# EAGLE design thermal-flashlight-32u4-many (EAGLE 6.5.0)
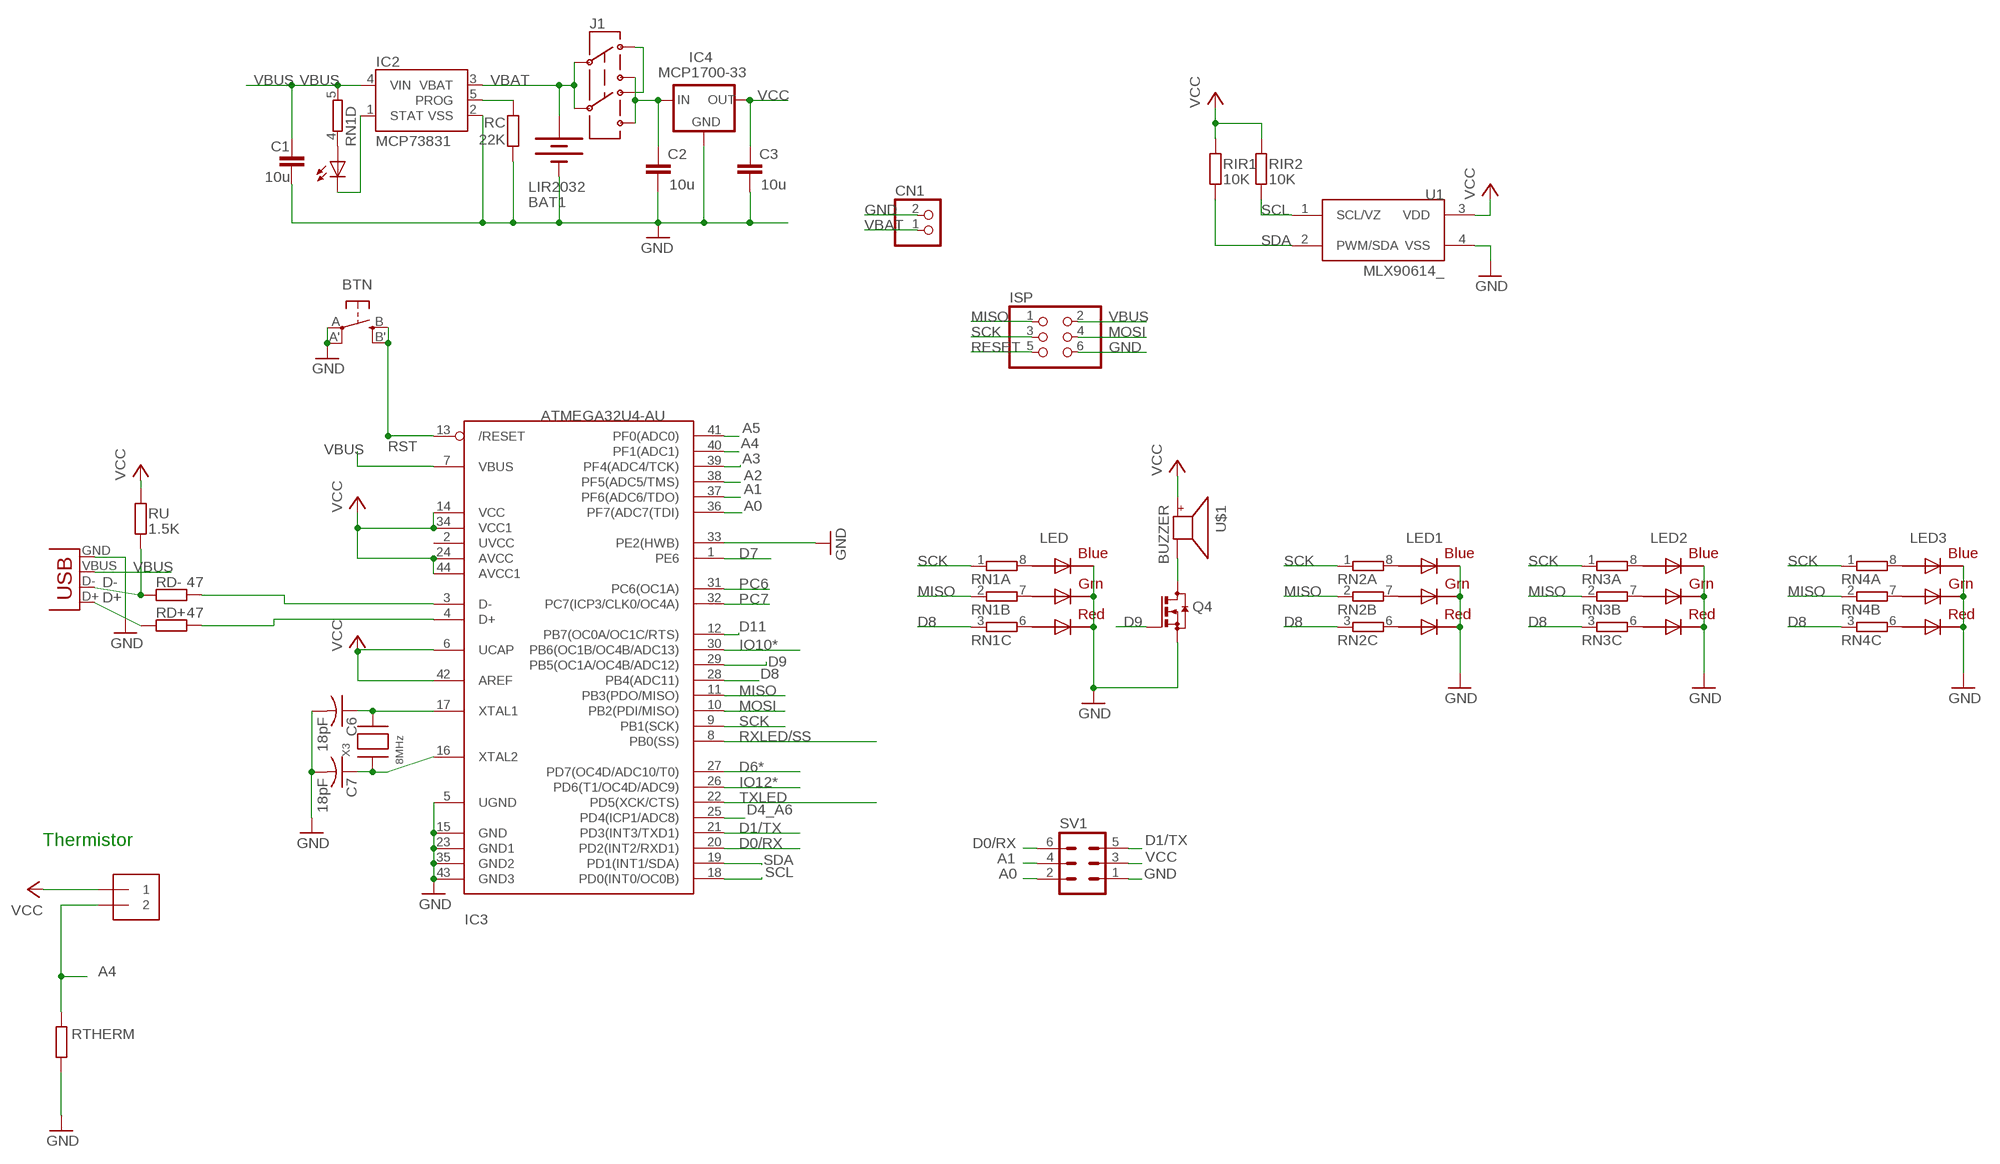
[diagram p0: schematic, sheet 1]

## Parts
BAT1  LIR2032  BATTERYBATTCOM_20MM_PTH_SMT  [BATTCOM_20MM_PTH_SMT]
BTN  EVQQ2  [EVQ-Q2]
C1  10u  C-EUC0805  [C0805]
C2  10u  C-EUC0805  [C0805]
C3  10u  C-EUC0805  [C0805]
C6  18pF  C-USC0805K  [C0805K]
C7  18pF  C-USC0805K  [C0805K]
CHG  0805  LEDCHIPLED_0805  [CHIPLED_0805]
CN1  JST_2PIN-SMT-RA  [JST-PH-2-SMT-RA]
IC2  MCP73831  [SOT23-5]
IC3  ATMEGA32U4-AU  [TQFP44]
IC4  MCP1700-33  MCP1700SOT233  [SOT23]
ISP  PINHD-2X3  [2X03]
J1  AYZ0202  [AYZ0202]
J2  1X2-3.5MM  [1X2-3.5MM]
LED  RGBLED5050  [RGBLED5050]
LED1  RGBLED5050  [RGBLED5050]
LED2  RGBLED5050  [RGBLED5050]
LED3  RGBLED5050  [RGBLED5050]
Q4  BSS123  [SOT23]
RC  22K  R-EU_R0805  [R0805]
RD+  47  R-EU_R0805  [R0805]
RD-  47  R-EU_R0805  [R0805]
RIR1  10K  R-EU_R0805  [R0805]
RIR2  10K  R-EU_R0805  [R0805]
RN1  4R-NEXB38V  [EXB38V]
RN2  4R-NEXB38V  [EXB38V]
RN3  4R-NEXB38V  [EXB38V]
RN4  4R-NEXB38V  [EXB38V]
RTHERM  330  R-EU_0204/7  [0204/7]
RU  1.5K  R-EU_R0805  [R0805]
SV1  MA03-2  [MA03-2]
U1  MLX90614_  [TO-39]
U$1  BUZZER  [SMT-8585-BUZZER]
X1  USBSMD  [USB-MINIB]
X3  8MHz  XTALNX5032  [NX5032]

## Nets
A0: IC3.36(PF7(ADC7(TDI)) SV1.2
A1: IC3.37(PF6(ADC6/TDO)) SV1.4
A2: IC3.38(PF5(ADC5/TMS))
A3: IC3.39(PF4(ADC4/TCK))
A4: IC3.40(PF1(ADC1)) J2.2 RTHERM.2
A5: IC3.41(PF0(ADC0))
D0/RX: IC3.20(PD2(INT2/RXD1)) SV1.6
D1/TX: IC3.21(PD3(INT3/TXD1)) SV1.5
D4_A6: IC3.25(PD4(ICP1/ADC8))
D6*: IC3.27(PD7(OC4D/ADC10/T0))
D7: IC3.1(PE6)
D8: IC3.28(PB4(ADC11)) RN1.3 RN2.3 RN3.3 RN4.3
D9: IC3.29(PB5(OC1A/OC4B/ADC12)) Q4.1(G)
D11: IC3.12(PB7(OC0A/OC1C/RTS))
D+: RD+.1 X1.D+
D-: RD-.1 RU.1 X1.D-
GND: BAT1.P$1(-) BTN.A'(P1) BTN.A(P) C1.2 C2.2 C3.2 C6.2 C7.2 CN1.2 IC2.2(VSS) IC3.5(UGND) IC3.15(GND) IC3.23(GND1) IC3.33(PE2(HWB)) IC3.35(GND2) IC3.43(GND3) IC4.1(GND) ISP.6 LED1.4(BLUE_C) LED1.5(RED_C) LED1.6(GREEN_C) LED2.4(BLUE_C) LED2.5(RED_C) LED2.6(GREEN_C) LED3.4(BLUE_C) LED3.5(RED_C) LED3.6(GREEN_C) LED.4(BLUE_C) LED.5(RED_C) LED.6(GREEN_C) Q4.2(S) RC.1 RTHERM.1 SV1.1 U1.4(VSS) X1.GND
IO10*: IC3.30(PB6(OC1B/OC4B/ADC13))
IO12*: IC3.26(PD6(T1/OC4D/ADC9))
MISO: IC3.11(PB3(PDO/MISO)) ISP.1 RN1.2 RN2.2 RN3.2 RN4.2
MOSI: IC3.10(PB2(PDI/MISO)) ISP.4
N$1: J1.3 J1.6
N$2: LED1.3(BLUE_A) RN2.8
N$3: LED1.1(GREEN_A) RN2.7
N$4: LED.3(BLUE_A) RN1.8
N$5: CHG.C IC2.1(STAT)
N$6: IC2.5(PROG) RC.2
N$7: Q4.3(D) U$1.-
N$8: LED.1(GREEN_A) RN1.7
N$9: LED.2(RED_A) RN1.6
N$10: CHG.A RN1.4
N$11: IC3.4(D+) RD+.2
N$12: LED1.2(RED_A) RN2.6
N$13: LED2.3(BLUE_A) RN3.8
N$14: LED2.1(GREEN_A) RN3.7
N$15: C7.1 IC3.16(XTAL2) X3.P$1
N$16: C6.1 IC3.17(XTAL1) X3.P$2
N$17: LED2.2(RED_A) RN3.6
N$18: IC3.3(D-) RD-.2
N$19: LED3.3(BLUE_A) RN4.8
N$20: LED3.1(GREEN_A) RN4.7
N$21: LED3.2(RED_A) RN4.6
PC6: IC3.31(PC6(OC1A))
PC7: IC3.32(PC7(ICP3/CLK0/OC4A))
RESET: ISP.5
RST: BTN.B'(S1) BTN.B(S) IC3.13(/RESET)
RXLED/SS: IC3.8(PB0(SS))
SCK: IC3.9(PB1(SCK)) ISP.3 RN1.1 RN2.1 RN3.1 RN4.1
SCL: IC3.18(PD0(INT0/OC0B)) RIR2.1 U1.1(SCL/VZ)
SDA: IC3.19(PD1(INT1/SDA)) RIR1.1 U1.2(PWM/SDA)
TXLED: IC3.22(PD5(XCK/CTS))
VBAT: BAT1.P$2(+) CN1.1 IC2.3(VBAT) J1.2 J1.5
VBUS: C1.1 IC2.4(VIN) IC3.7(VBUS) ISP.2 RN1.5 X1.VBUS
VCC: C3.1 IC3.6(UCAP) IC3.14(VCC) IC3.24(AVCC) IC3.34(VCC1) IC3.42(AREF) IC3.44(AVCC1) IC4.2(OUT) J2.1 RIR1.2 RIR2.2 RU.2 SV1.3 U1.3(VDD) U$1.+
VDD: C2.1 IC4.3(IN) J1.1 J1.4
Unconnected: IC3.2(UVCC) RN2.4 RN2.5 RN3.4 RN3.5 RN4.4 RN4.5

## Notes on the sheet
- Thermistor

## Library data of the parts
BAT1 = SparkFunNew:BATTERY: Battery Holders Various common sizes : AA, AAA, 20mm coin cell and 12mm coin cell.
BTN = adafruit:EVQQ2: SMT 6mm switch, EVQQ2 series http://www.ladyada.net/library/eagle
C1-C3 = resistor:C-EU: CAPACITOR, European symbol
C6 C7 = adafruit:C-US: CAPACITOR, American symbol
CHG = led:LED: LED OSRAM: - CHIPLED LG R971, LG N971, LY N971, LG Q971, LY Q971, LO R971, LY R971 LH N974, LH R974 LS Q976, LO Q976, LY Q976 LO Q996 - Hyper CHIPLED LW Q18S LB Q993, LB Q99A, LB R99A - SideLED LS A670, LO A670, LY A670, LG A670, LP A670 LB A673, LV A673, LT A673, LW A673 LH A674 LY A675 LS A676, LA A676, LO A676, LY A676, LW A676 LS A679, LY A679, LG A679 - Hyper Micro SIDELED® LS Y876, LA Y876, LO Y876, LY Y876 LT Y87S - SmartLED LW L88C, LW L88S LB L89C, LB L89S, LG L890 LS L89K, LO L89K, LY L89K LS L896, LA L896, LO L896, LY L896 - TOPLED LS T670, LO T670, LY T670, LG T670, LP T670 LSG T670, LSP T670, LSY T670, LOP T670, LYG T670 LG T671, LOG T671, LSG T671 LB T673, LV T673, LT T673, LW T673 LH T674 LS T676, LA T676, LO T676, LY T676, LB T676, LH T676, LSB T676, LW T676 LB T67C, LV T67C, LT T67C, LS T67K, LO T67K, LY T67K, LW E67C LS E67B, LA E67B, LO E67B, LY E67B, LB E67C, LV E67C, LT E67C LW T67C LS T679, LY T679, LG T679 LS T770, LO T770, LY T770, LG T770, LP T770 LB T773, LV T773, LT T773, LW T773 LH T774 LS E675, LA E675, LY E675, LS T675 LS T776, LA T776, LO T776, LY T776, LB T776 LHGB T686 LT T68C, LB T68C - Hyper Mini TOPLED® LB M676 - Mini TOPLED Santana® LG M470 LS M47K, LO M47K, LY M47K Source: http://www.osram.convergy.de LUXEON: - LUMILED® LXK2-PW12-R00, LXK2-PW12-S00, LXK2-PW14-U00, LXK2-PW14-V00 LXK2-PM12-R00, LXK2-PM12-S00, LXK2-PM14-U00 LXK2-PE12-Q00, LXK2-PE12-R00, LXK2-PE12-S00, LXK2-PE14-T00, LXK2-PE14-U00 LXK2-PB12-K00, LXK2-PB12-L00, LXK2-PB12-M00, LXK2-PB14-N00, LXK2-PB14-P00, LXK2-PB14-Q00 LXK2-PR12-L00, LXK2-PR12-M00, LXK2-PR14-Q00, LXK2-PR14-R00 LXK2-PD12-Q00, LXK2-PD12-R00, LXK2-PD12-S00 LXK2-PH12-R00, LXK2-PH12-S00 LXK2-PL12-P00, LXK2-PL12-Q00, LXK2-PL12-R00 Source: www.luxeon.com KINGBRIGHT: KA-3528ASYC Source: www.kingbright.com
CN1 = adafruit:JST_2PIN: JST 2-Pin Connectors of various flavors SMT-RA (S2B-PH-SM4) 4UConnector #17311 SMT (B2B-PH-SM4) THM-RA (S2B-PH) THM (B2B-PH)
IC2 = SparkFunNew:MCP73831: Microchip's MCP73831 Miniature single cell, fully integrated Li-Ion, Li-polymer charge management controller http://ww1.microchip.com/downloads/en/DeviceDoc/21984a.pdf
IC3 = adaprog:ATMEGA32U4
IC4 = adafruit:MCP1700: VOLTAGE REGULATOR
ISP = pinhead:PINHD-2X3: PIN HEADER
J1 = SparkFunNew:AYZ0202: SPDT Slide Switch Simple SMD single-pull double-throw slide switch. Good for less than 350mA power switch, switching UARTs between devices, etc. Spark Fun Electronics SKU : COM-00597
J2 = adafruit:1X2: 3.5mm Terminal block http://www.ladyada.net/library/pcb/eaglelibrary.html
LED LED1-LED3 = adafruit:RGBLED: For 5050 RGB LEDs, the order of the LEDs may vary from one manufacturer to another!
Q4 = transistor-small-signal:BSS123: N-CHANNEL MOS FET
RC RD+ RD- RIR1 RIR2 RTHERM RU = rcl:R-EU_: RESISTOR, European symbol
RN1-RN4 = resistor-dil:4R-N: Array Chip Resistor Source: RS Component / Phycomp; OC_FARNELL: unknown; OC_NEWARK: unknown
SV1 = con-lstb:MA03-2: PIN HEADER; OC_FARNELL: unknown; OC_NEWARK: unknown
U1 = SparkFun:MLX90614: Melexis IR Thermometer
U$1 = adafruit:BUZZER
X1 = SparkFun:USB: USB Connectors USB-B-PTH is fully proven SKU : PRT-00139 USB-miniB is fully proven SKU : PRT-00587 USB-A-PCB is untested. USB-A-H is throughly reviewed, but untested. Spark Fun Electronics SKU : PRT-00437 USB-B-SMT is throughly reviewed, but untested. Needs silkscreen touching up. USB-A-S has not been used/tested USB-MB-H has not been used/tested
X3 = adaprog:XTAL

## Net classes
1 power: width 0.254 mm, clearance 0.203 mm

## Board
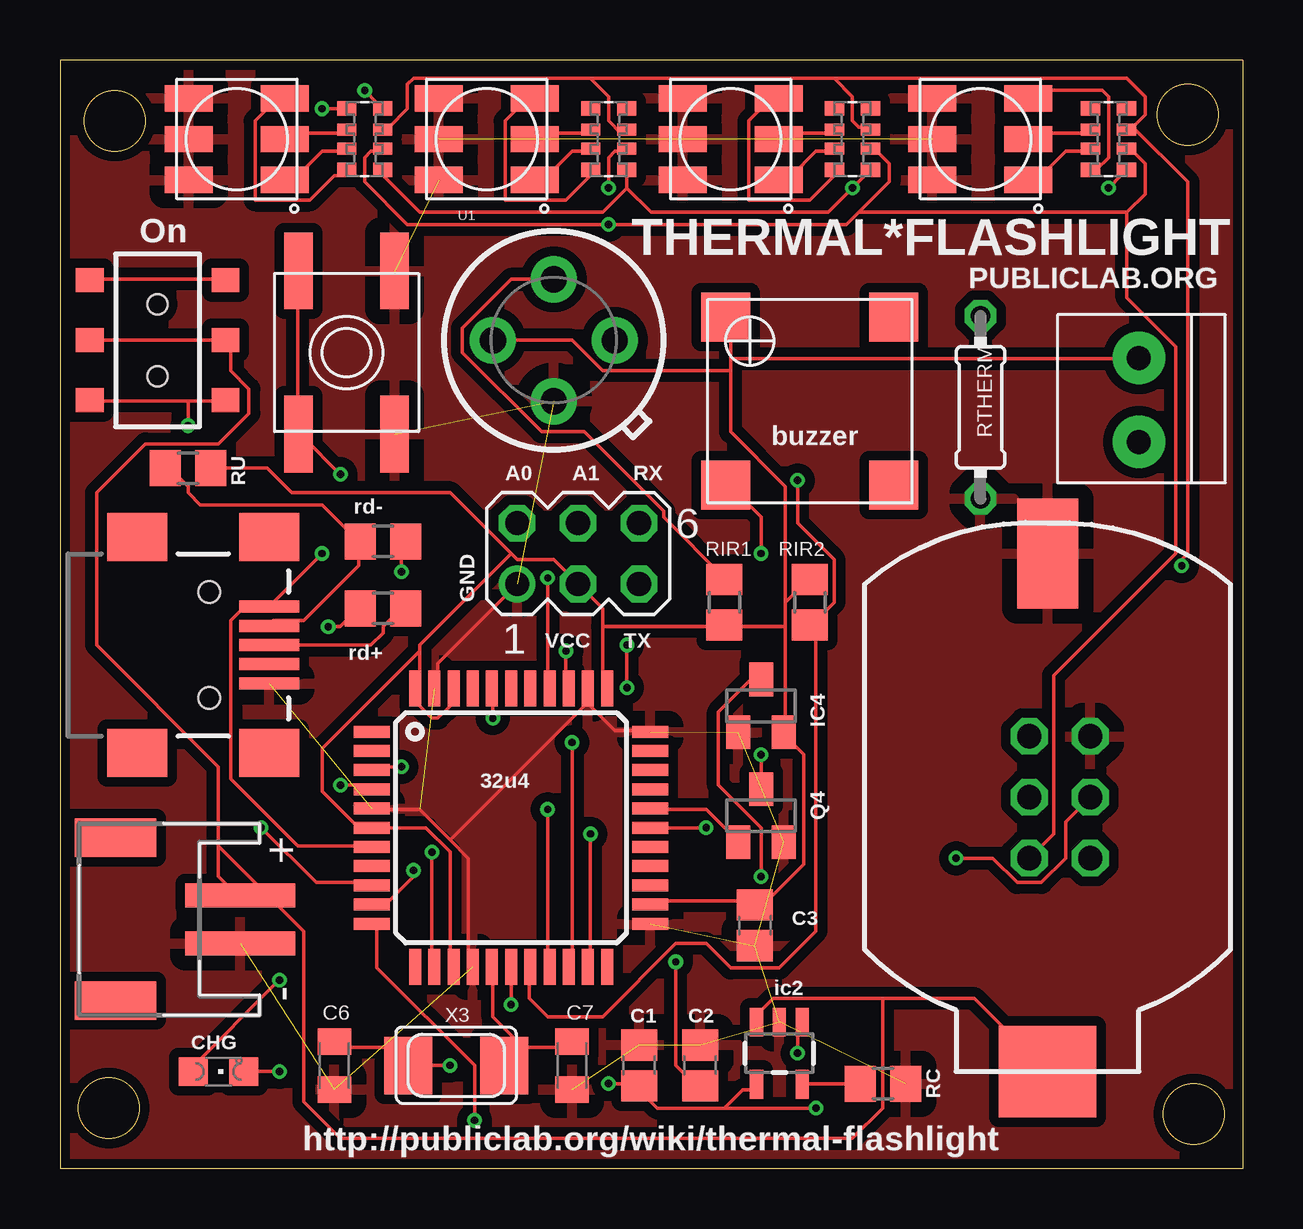
[diagram p1: board, top side]
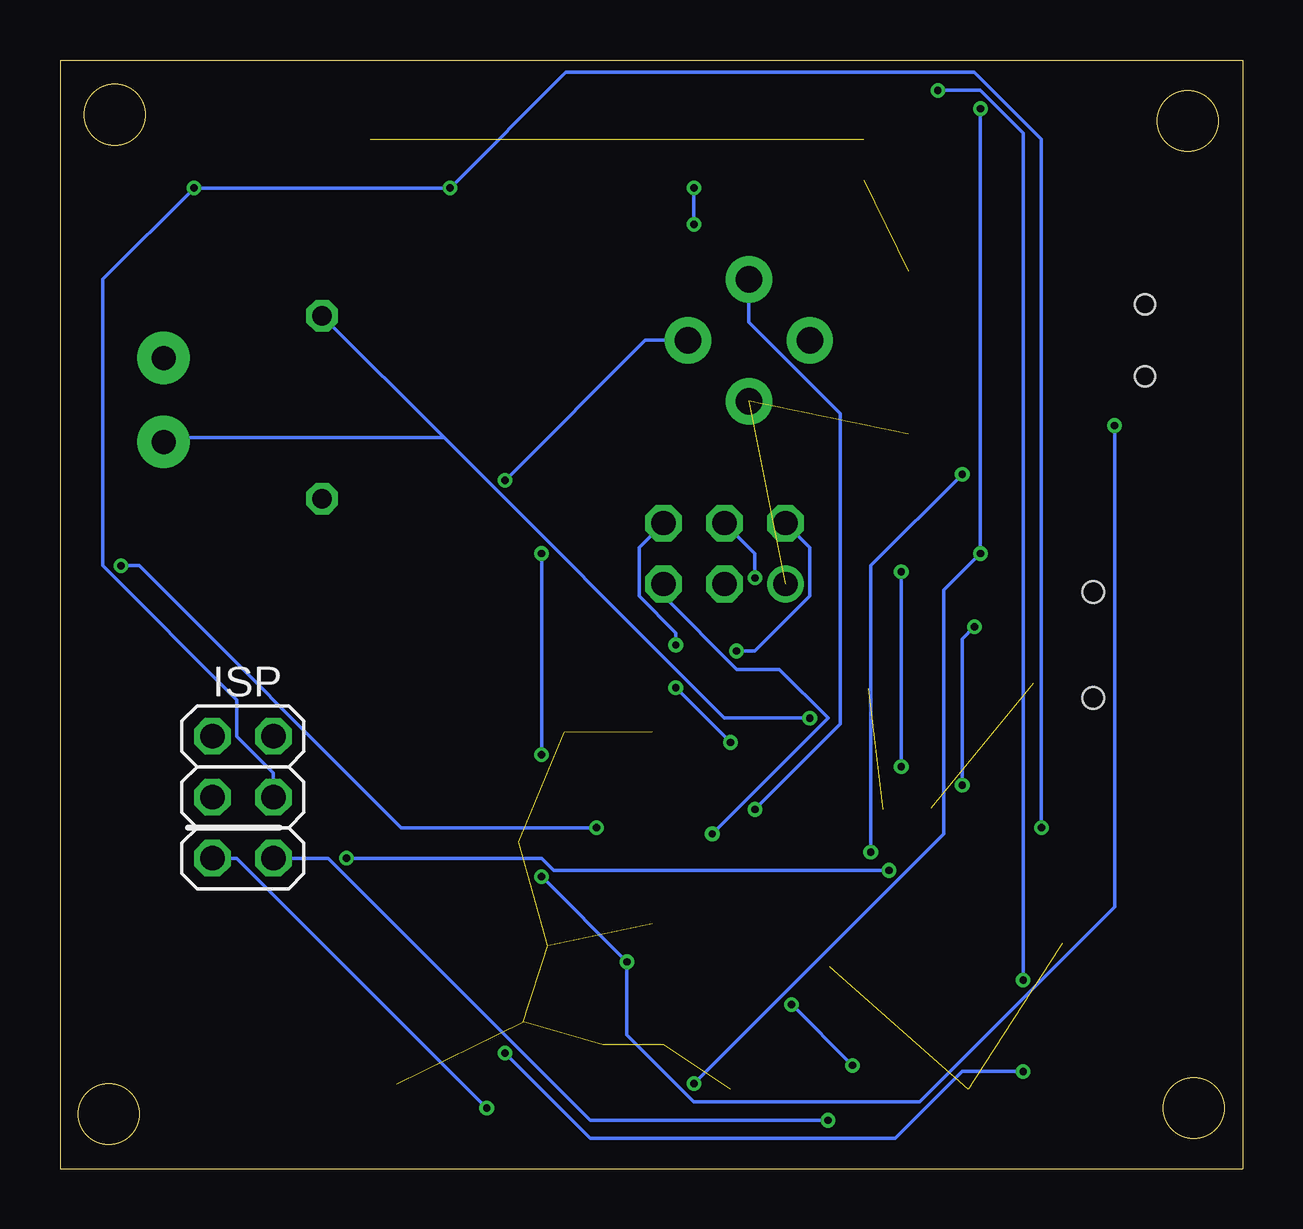
[diagram p2: board, bottom side, seen from below]

Size 49.28 x 46.23 mm. Coordinates in mm from the lower left corner, seen from the top.
Outline: 49.28,46.23 0,46.23 0,0 49.28,0 49.28,46.23
Outline: circle at 2.03,2.54 radius 1.27
Outline: circle at 2.29,43.69 radius 1.27
Outline: circle at 46.99,43.94 radius 1.27
Outline: circle at 47.24,2.29 radius 1.27
Copper layers (1*16): Top 0.035mm / dielectric 1.5mm / Bottom 0.035mm
Design rules "Fusion_eagle_rule_v1.1 *": minimum track width 6mil, minimum drill 12mil, track to track 6mil, track to pad 6mil, pad to pad 6mil, via to via 6mil, smd to smd 0mil, copper to edge 10mil, drill to drill 10mil, minimum pad ring 10mil, minimum via ring 6mil, stop-mask expansion 2mil, vias tented up to drill 100mil, thermal gap 25mil
vRestrict: area 5.8,3.6 to 7.4,4.3

### Footprints (pad centres in the part's own frame; a part is rotated, then mirrored left to right if it is on the bottom)
BATTCOM_20MM_PTH_SMT = smd 4.572 x 2.54: P$1 0,0 | smd 3.81 x 4.064: P$2 21.59,0
EVQ-Q2 = smd 3.2 x 1.2: A -3.4,-2; A' 3.4,-2; B -3.4,2; B' 3.4,2
C0805 = smd 1.3 x 1.5: 1 -0.85,0; 2 0.85,0
C0805K = smd 1.1 x 1.4: 1 -1,0; 2 1,0
CHIPLED_0805 = smd 1.2 x 1.2: A 0,-1.05; C 0,1.05
JST-PH-2-SMT-RA = smd 1 x 4.6: 1 1,-3.7; 2 -1,-3.7 | smd 1.6 x 3.4: NC1 -3.4,1.5; NC2 3.4,1.5
SOT23-5 = smd 0.55 x 1.2: 1 -0.95,-1.3; 2 0,-1.3; 3 0.95,-1.3; 4 0.95,1.3; 5 -0.95,1.3
TQFP44 = smd 1.5 x 0.5: 1 -5.8,4; 2 -5.8,3.2; 3 -5.8,2.4; 4 -5.8,1.6; 5 -5.8,0.8; 6 -5.8,0; 7 -5.8,-0.8; 8 -5.8,-1.6; 9 -5.8,-2.4; 10 -5.8,-3.2; 11 -5.8,-4; 23 5.8,-4; 24 5.8,-3.2; 25 5.8,-2.4; 26 5.8,-1.6; 27 5.8,-0.8; 28 5.8,0; 29 5.8,0.8; 30 5.8,1.6; 31 5.8,2.4; 32 5.8,3.2; 33 5.8,4 | smd 0.5 x 1.5: 12 -4,-5.8; 13 -3.2,-5.8; 14 -2.4,-5.8; 15 -1.6,-5.8; 16 -0.8,-5.8; 17 0,-5.8; 18 0.8,-5.8; 19 1.6,-5.8; 20 2.4,-5.8; 21 3.2,-5.8; 22 4,-5.8; 34 4,5.8; 35 3.2,5.8; 36 2.4,5.8; 37 1.6,5.8; 38 0.8,5.8; 39 0,5.8; 40 -0.8,5.8; 41 -1.6,5.8; 42 -2.4,5.8; 43 -3.2,5.8; 44 -4,5.8
SOT23 = smd 1 x 1.4: 1 -0.95,-1.1; 2 0.95,-1.1; 3 0,1.1
2X03 = drill 1.016 octagon: 1 -2.54,-1.27; 2 -2.54,1.27; 3 0,-1.27; 4 0,1.27; 5 2.54,-1.27; 6 2.54,1.27
AYZ0202 = smd 1 x 1.15: 1 -2.5,2.825; 2 0,2.825; 3 2.5,2.825; 4 -2.5,-2.825; 5 0,-2.825; 6 2.5,-2.825 | hole 0.85: 1.5,0; -1.5,0
1X2-3.5MM = drill 1 pad 2.184: 1 1.8,0; 2 -1.7,0
RGBLED5050 = smd 2 x 1.1: 1 -2,1.7; 2 -2,0; 3 -2,-1.7; 4 2,-1.7; 5 2,0; 6 2,1.7
R0805 = smd 1.3 x 1.5: 1 -0.95,0; 2 0.95,0
EXB38V = smd 0.6 x 0.8: 1 -1.275,-0.75; 4 1.275,-0.75; 5 1.275,0.75; 8 -1.275,0.75 | smd 0.5 x 0.8: 2 -0.4,-0.75; 3 0.4,-0.75; 6 0.4,0.75; 7 -0.4,0.75
0204/7 = drill 0.813 octagon: 1 -3.81,0; 2 3.81,0
MA03-2 = drill 1.016: 1 -2.54,-1.27 | drill 1.016 octagon: 2 -2.54,1.27; 3 0,-1.27; 4 0,1.27; 5 2.54,-1.27; 6 2.54,1.27
TO-39 = drill 1.1 pad 1.93: 1 2.54,0; 2 0,2.54; 3 -2.54,0; 4 0,-2.54
SMT-8585-BUZZER = smd 2.05 x 2.05: + -3.5,-3.5; - 3.5,-3.5; NC1 -3.5,3.5; NC2 3.5,3.5
USB-MINIB = smd 2.5 x 0.5: D+ 2.5,0; D- 2.5,0.8; GND 2.5,-1.6; ID 2.5,-0.8; VBUS 2.5,1.6 | smd 2.5 x 2: GND@1 -3,-4.5; GND@2 -3,4.5; GND@3 2.5,4.5; GND@4 2.5,-4.5 | hole 0.9: 0,2.2; 0,-2.2
NX5032 = smd 2 x 2.4: P$1 2,0; P$2 -2,0

### Placement (x,y rotation side)
BAT1  41.15,25.65 270 top
BTN  11.94,34.04 90 top
C1  24.13,4.32 90 top
C2  26.67,4.32 90 top
C3  28.96,10.16 270 top
C6  11.43,4.32 270 top
C7  21.34,4.32 270 top
CHG  6.6,4.06 270 top
CN1  3.81,10.41 90 top
IC2  29.97,4.83 180 top
IC3  18.8,14.22 0 top
IC4  29.21,19.3 0 top
ISP  41.66,15.49 90 bottom
J1  4.06,34.54 90 top
J2  44.96,32 90 top
LED  7.37,42.93 180 top
LED1  17.78,42.93 180 top
LED2  27.94,42.93 180 top
LED3  38.35,42.93 180 top
Q4  29.21,14.73 0 top
RC  34.29,3.56 180 top
RD+  13.46,23.37 180 top
RD-  13.46,26.16 0 top
RIR1  27.69,23.62 270 top
RIR2  31.24,23.62 90 top
RN1  12.7,42.93 90 top
RN2  22.86,42.93 90 top
RN3  33.02,42.93 90 top
RN4  43.69,42.93 90 top
RTHERM  38.35,31.75 90 top
RU  5.33,29.21 0 top
SV1  21.59,25.65 0 top
U1  20.57,34.54 0 top
U$1  31.24,32 270 top
X1  6.22,21.84 0 top
X3  16.51,4.32 0 top

### Tracks (layer width: path | path; a pad name or v marks a point on that pad's centre or on a via)
A0  (via drill 0.3)
  Top 0.152: v21.08,21.59 21.08,20.07 IC3.36
  Bottom 0.152: v21.08,21.59 20.32,21.59 18.03,23.88 18.03,25.91 SV1.2
A1  (via drill 0.3)
  Top 0.152: v20.32,24.64 20.32,20.07 IC3.37
  Bottom 0.152: v20.32,24.64 20.32,25.65 SV1.4
A4  (via drill 0.3)
  Top 0.152: v18.03,18.8 18.03,19.81 IC3.40
  Bottom 0.152: v18.03,18.8 21.59,18.8 33.27,30.48 | RTHERM.2 33.27,30.48 | 33.27,30.48 44.96,30.48 J2.2
D0/RX  (via drill 0.3)
  Top 0.152: v21.34,17.78 21.34,8.64 IC3.20 | v23.62,21.84 v23.62,20.07
  Bottom 0.152: v23.62,20.07 v21.34,17.78 | v23.62,21.84 23.62,22.35 25.15,23.88 25.15,25.91 SV1.6
D1/TX  (via drill 0.3)
  Top 0.152: v22.1,13.97 22.1,8.64 IC3.21
  Bottom 0.152: v22.1,13.97 17.27,18.8 19.3,20.83 21.08,20.83 24.13,23.88 SV1.5
D8  (via drill 0.3)
  Top 0.152: 22.1,45.47 14.73,45.47 14.48,45.21 14.48,44.2 13.72,43.43 13.46,43.43 RN1.3 | 22.1,45.47 22.86,44.7 22.86,43.69 23.37,43.18 RN2.3 | 32.26,45.47 33.02,44.7 33.02,43.69 33.27,43.43 33.53,43.43 RN3.3 | 22.1,45.47 32.26,45.47 | 44.7,43.43 44.45,43.43 RN4.3 44.7,43.43 | 44.7,43.43 45.21,43.94 45.21,44.7 44.45,45.47 32.26,45.47 | v26.92,14.22 IC3.28 | v46.74,25.15 46.74,25.4 46.99,25.65 46.99,41.15 44.7,43.43
  Bottom 0.152: v26.92,14.22 35.05,14.22 45.97,25.15 v46.74,25.15
D9
  Top 0.152: Q4.1 28.19,13.72 26.92,14.99 24.64,14.99 IC3.29
D+
  Top 0.152: X1.D+ 12.95,21.84 13.46,22.35 13.46,22.61 14.22,23.37 RD+.1
D-
  Top 0.152: 12.45,26.16 10.92,27.69 5.84,27.69 5.33,28.19 5.33,28.45 4.57,29.21 RU.1 | 12.45,26.16 12.45,25.15 10.16,22.86 8.89,22.86 X1.D- | 12.45,26.16 RD-.1
GND  (18 unrouted)
  Top 0.152: 16.26,13.72 14.99,14.99 13.21,14.99 IC3.5 | 16.26,13.72 17.02,12.95 17.02,8.64 IC3.15 | SV1.1 15.75,21.08 15.75,20.07 IC3.43 | 22.1,19.56 22.1,19.3 23.11,18.29 24.38,18.29 IC3.33 | 22.1,19.56 22.1,19.81 IC3.35 22.1,19.56 | 22.1,19.56 16.26,13.72
  pour Top (isolate 0.406): 0.25,45.97 49.02,45.97 49.02,0.25 0.25,0.25
MISO  (via drill 0.3)
  Top 0.152: 33.27,39.88 34.54,41.15 34.54,41.91 33.78,42.67 RN3.2 | 33.27,39.88 32.77,39.37 v22.86,39.37 14.48,39.37 12.7,41.15 12.7,42.16 12.95,42.42 13.21,42.42 RN1.2 | v22.86,40.89 22.86,42.16 23.11,42.42 23.37,42.42 RN2.2 | 44.45,39.88 45.21,40.64 45.21,41.91 44.7,42.42 44.45,42.42 RN4.2 | 33.27,39.88 44.45,39.88 | v17.27,2.03 17.27,4.32 13.21,8.38 13.21,10.16 IC3.11 | 44.45,39.88 44.45,36.32 46.48,34.29 46.48,25.65 41.4,20.57 41.4,13.97 ISP.1
  Bottom 0.152: v22.86,39.37 v22.86,40.89 | v17.27,2.03 27.18,2.03 38.1,12.95 ISP.1
MOSI  (via drill 0.3)
  Top 0.152: v14.73,12.45 14.73,12.19 13.72,11.18 13.21,11.18 IC3.10 | v37.34,12.95 38.86,12.95 39.88,11.94 40.89,11.94 41.91,12.95 41.91,14.48 ISP.4
  Bottom 0.152: v14.73,12.45 28.7,12.45 29.21,12.95 v37.34,12.95
N$1
  Top 0.152: J1.3 1.27,37.08 6.86,37.08 J1.6
N$2
  Top 0.152: RN2.8 22.1,41.4 21.08,40.39 18.54,40.39 18.54,43.69 19.56,44.7 LED1.3
N$3
  Top 0.152: RN2.7 22.1,42.42 21.34,42.42 20.32,41.4 19.81,41.4 LED1.1
N$4
  Top 0.152: RN1.8 11.94,41.4 11.43,41.4 10.41,40.39 8.13,40.39 8.13,43.69 9.14,44.7 LED.3
N$5  (via drill 0.3)
  Top 0.152: v9.14,4.06 CHG.C | v30.73,4.83 30.73,6.1 IC2.1
  Bottom 0.152: v9.14,4.06 11.68,4.06 14.48,1.27 27.18,1.27 v30.73,4.83
N$6
  Top 0.152: RC.2 30.99,3.56 IC2.5
N$7  (via drill 0.3)
  Top 0.152: v29.21,17.27 Q4.3 | v29.21,25.65 29.21,27.18 27.94,28.45 U$1.-
  Bottom 0.152: v29.21,25.65 v29.21,17.27
N$8
  Top 0.152: RN1.7 11.94,42.42 10.92,42.42 9.91,41.4 9.4,41.4 LED.1
N$9
  Top 0.152: RN1.6 11.94,43.18 9.65,43.18 9.4,42.93 LED.2
N$10  (via drill 0.3)
  Top 0.152: v12.7,44.96 13.21,44.45 RN1.4 | v9.14,7.87 5.33,4.06 CHG.A
  Bottom 0.152: v12.7,44.96 10.92,44.96 9.14,43.18 v9.14,7.87
N$11  (via drill 0.3)
  Top 0.152: v11.68,16 12.95,16 IC3.4 | v11.18,22.61 11.68,22.61 12.45,23.37 RD+.2
  Bottom 0.152: v11.68,16 11.68,22.1 v11.18,22.61
N$12
  Top 0.152: RN2.6 22.1,43.18 20.07,43.18 19.81,42.93 LED1.2
N$13
  Top 0.152: RN3.8 32.26,41.4 31.24,40.39 28.7,40.39 28.7,43.69 29.72,44.7 LED2.3
N$14
  Top 0.152: RN3.7 32.26,42.42 31.5,42.42 30.48,41.4 29.97,41.4 LED2.1
N$15
  Top 0.152: 19.3,5.08 21.34,5.08 C7.1 | 19.3,5.08 18.54,4.32 X3.P$1 19.3,5.08 | 19.3,5.08 18.03,6.35 18.03,8.38 IC3.16
N$16  (via drill 0.3)
  Top 0.152: C6.1 11.43,5.08 13.72,5.08 14.48,4.32 X3.P$2 v16.26,4.32 | v18.8,6.86 IC3.17
  Bottom 0.152: v16.26,4.32 v18.8,6.86
N$17
  Top 0.152: RN3.6 32.26,43.18 30.23,43.18 29.97,42.93 LED2.2
N$18  (via drill 0.3)
  Top 0.152: v14.22,16.76 13.21,16.76 IC3.3 | v14.22,24.89 14.22,26.16 RD-.2
  Bottom 0.152: v14.22,24.89 v14.22,16.76
N$19
  Top 0.152: RN4.8 43.18,41.66 43.69,42.16 43.69,44.7 43.43,44.96 40.64,44.96 40.39,44.7 LED3.3
N$20
  Top 0.152: RN4.7 42.93,42.42 41.91,42.42 40.89,41.4 40.39,41.4 LED3.1
N$21
  Top 0.152: RN4.6 42.93,43.18 40.64,43.18 40.39,42.93 LED3.2
RST  (via drill 0.3)
  Top 0.152: v15.49,13.21 15.49,8.64 IC3.13 | v11.68,28.96 10.16,30.48 BTN.B 9.91,30.73 9.91,37.34 BTN.B'
  Bottom 0.152: v15.49,13.21 15.49,25.15 v11.68,28.96
SCK  (via drill 0.3)
  Top 0.152: 23.62,40.89 22.61,39.88 14.99,39.88 13.46,41.4 RN1.1 | 23.62,40.89 23.62,41.4 RN2.1 | 23.62,40.89 24.64,39.88 32,39.88 v33.02,40.89 33.53,41.4 RN3.1 | v43.69,40.89 44.2,41.4 RN4.1 | v8.38,14.22 10.67,11.94 12.95,11.94 IC3.9
  Bottom 0.152: v8.38,14.22 8.38,42.93 11.18,45.72 28.19,45.72 v33.02,40.89 v43.69,40.89 47.5,37.08 47.5,25.15 41.91,19.56 41.91,18.03 40.39,16.51 ISP.3
SCL  (via drill 0.3)
  Top 0.152: 31.24,22.61 31.5,22.35 31.5,9.91 29.97,8.38 27.94,8.38 26.92,9.4 25.65,9.4 22.61,6.35 20.32,6.35 19.56,7.11 19.56,8.38 IC3.18 | v30.73,28.7 30.73,26.92 32.26,25.4 32.26,23.62 31.24,22.61 | 31.24,22.61 RIR2.1
  Bottom 0.152: U1.1 24.89,34.54 v30.73,28.7
SDA  (via drill 0.3)
  Top 0.152: v20.32,14.99 20.32,8.64 IC3.19 | U1.2 18.8,37.08 16.76,35.05 16.76,34.04 20.07,30.73 21.84,30.73 25.15,27.43 25.15,27.18 27.69,24.64 RIR1.1
  Bottom 0.152: v20.32,14.99 16.76,18.54 16.76,31.5 20.57,35.31 U1.2
VBAT
  Top 0.152: 34.29,7.11 38.1,7.11 BAT1.P$2 | 34.29,7.11 29.72,7.11 29.21,6.6 29.21,6.35 IC2.3 | J1.2 J1.5 7.11,34.54 7.11,33.27 7.87,32.51 7.87,31.5 6.6,30.23 3.56,30.23 1.52,28.19 1.52,21.84 6.6,16.76 6.6,13.46 | 6.6,13.46 6.6,12.19 7.37,11.43 CN1.1 | 34.29,7.11 34.29,2.54 33.02,1.27 11.68,1.27 10.16,2.79 10.16,9.91 6.6,13.46
VBUS  (via drill 0.3)
  Top 0.152: 27.69,2.54 28.45,3.3 28.96,3.3 IC2.4 | 27.69,2.54 24.89,2.54 24.13,3.3 C1.1 24.13,3.56 v22.86,3.56 | 27.69,2.54 v31.5,2.54 | v10.92,44.2 RN1.5 | v10.92,25.65 8.89,23.62 X1.VBUS 8.64,23.37 7.62,23.37 7.11,22.86 7.11,16.26 9.91,13.46 12.95,13.46 IC3.7
  Bottom 0.152: ISP.2 41.91,12.95 v31.5,2.54 | v10.92,44.2 v10.92,25.65 12.45,24.13 12.45,13.97 v22.86,3.56
VCC
  Top 0.152: IC3.14 16.26,8.64 16.26,13.21 15.24,14.22 IC3.6 12.45,14.22 10.92,15.75 10.92,17.53 14.99,21.59 | IC3.42 16.26,19.81 16.26,19.3 15.75,18.8 15.49,18.8 14.99,19.3 14.99,19.81 IC3.44 14.99,20.07 14.99,21.59 | 22.61,22.61 22.61,23.37 SV1.3 20.57,25.4 19.05,25.4 18.8,25.65 | 22.61,22.61 22.61,20.07 IC3.34 | RU.2 8.64,29.21 9.65,28.19 16.26,28.19 18.8,25.65 | 14.99,21.59 14.99,21.84 18.8,25.65 | 28.96,11.18 24.64,11.18 IC3.24 | 30.23,23.62 30.23,22.61 | 30.23,22.61 30.23,18.29 IC4.2 30.23,18.03 30.99,17.27 30.99,12.7 29.46,11.18 28.96,11.18 | 30.23,23.62 31.24,24.64 RIR2.2 | 30.23,22.61 27.69,22.61 | 27.94,33.27 27.94,30.73 30.23,28.45 30.23,23.62 | 27.94,33.27 27.94,33.78 | 27.94,33.78 27.94,35.31 U$1.+ | 28.96,11.18 C3.1 | U1.3 21.34,34.54 22.61,33.27 27.94,33.27 | 27.94,33.78 44.96,33.78 J2.1 | 27.69,22.61 22.61,22.61 | 27.69,22.61 RIR1.2
VDD  (via drill 0.3)
  Top 0.152: 5.33,32 6.86,32 J1.4 | 5.33,32 1.27,32 J1.1 | v29.21,12.19 29.21,14.22 27.43,16 27.43,19.05 28.7,20.32 29.21,20.32 IC4.3 | v25.65,8.64 25.65,4.32 26.67,3.3 C2.1 | v5.33,30.99 5.33,32
  Bottom 0.152: v29.21,12.19 v25.65,8.64 25.65,5.59 22.86,2.79 13.46,2.79 5.33,10.92 v5.33,30.99

### Text on the board
tNames: THERMAL*FLASHLIGHT | On | PUBLICLAB.ORG | buzzer | A0 | A1 | RX | rd- | GND | rd+ | VCC | TX | IC4 | 32u4 | Q4 | ic2 | http://publiclab.org/wiki/thermal-flashlight